# EAGLE design Flyback Develop (EAGLE 9.6.2)
AUTH_NAME: MNa; REV_NO: A
Assembly variants: Assembly_1

## Sheet 1 of 2: Concept
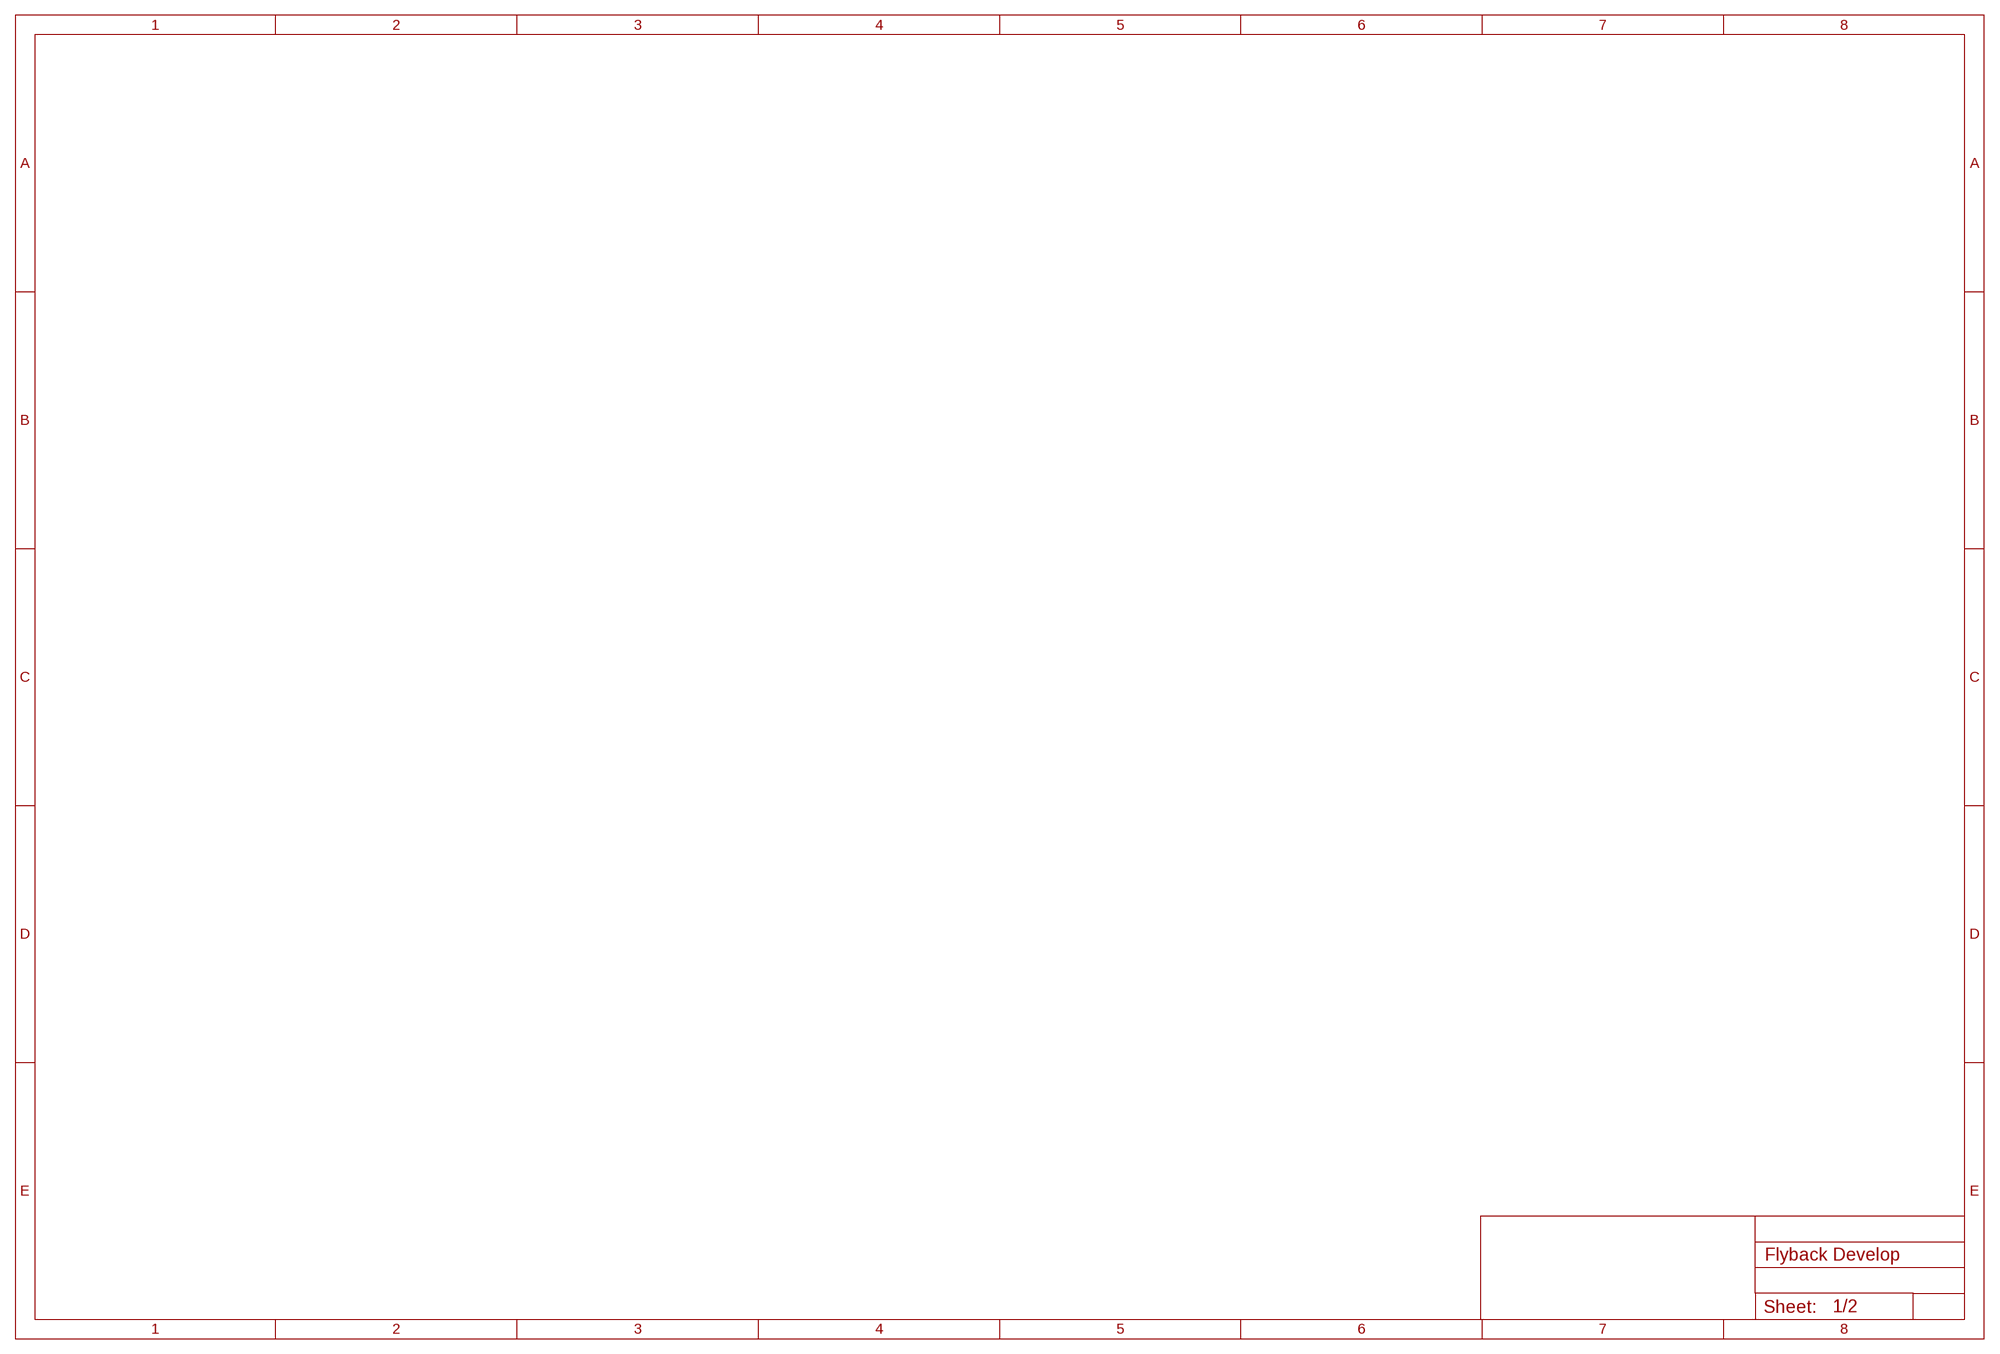
[diagram p0: schematic, sheet 1]

## Sheet 2 of 2: Inputs
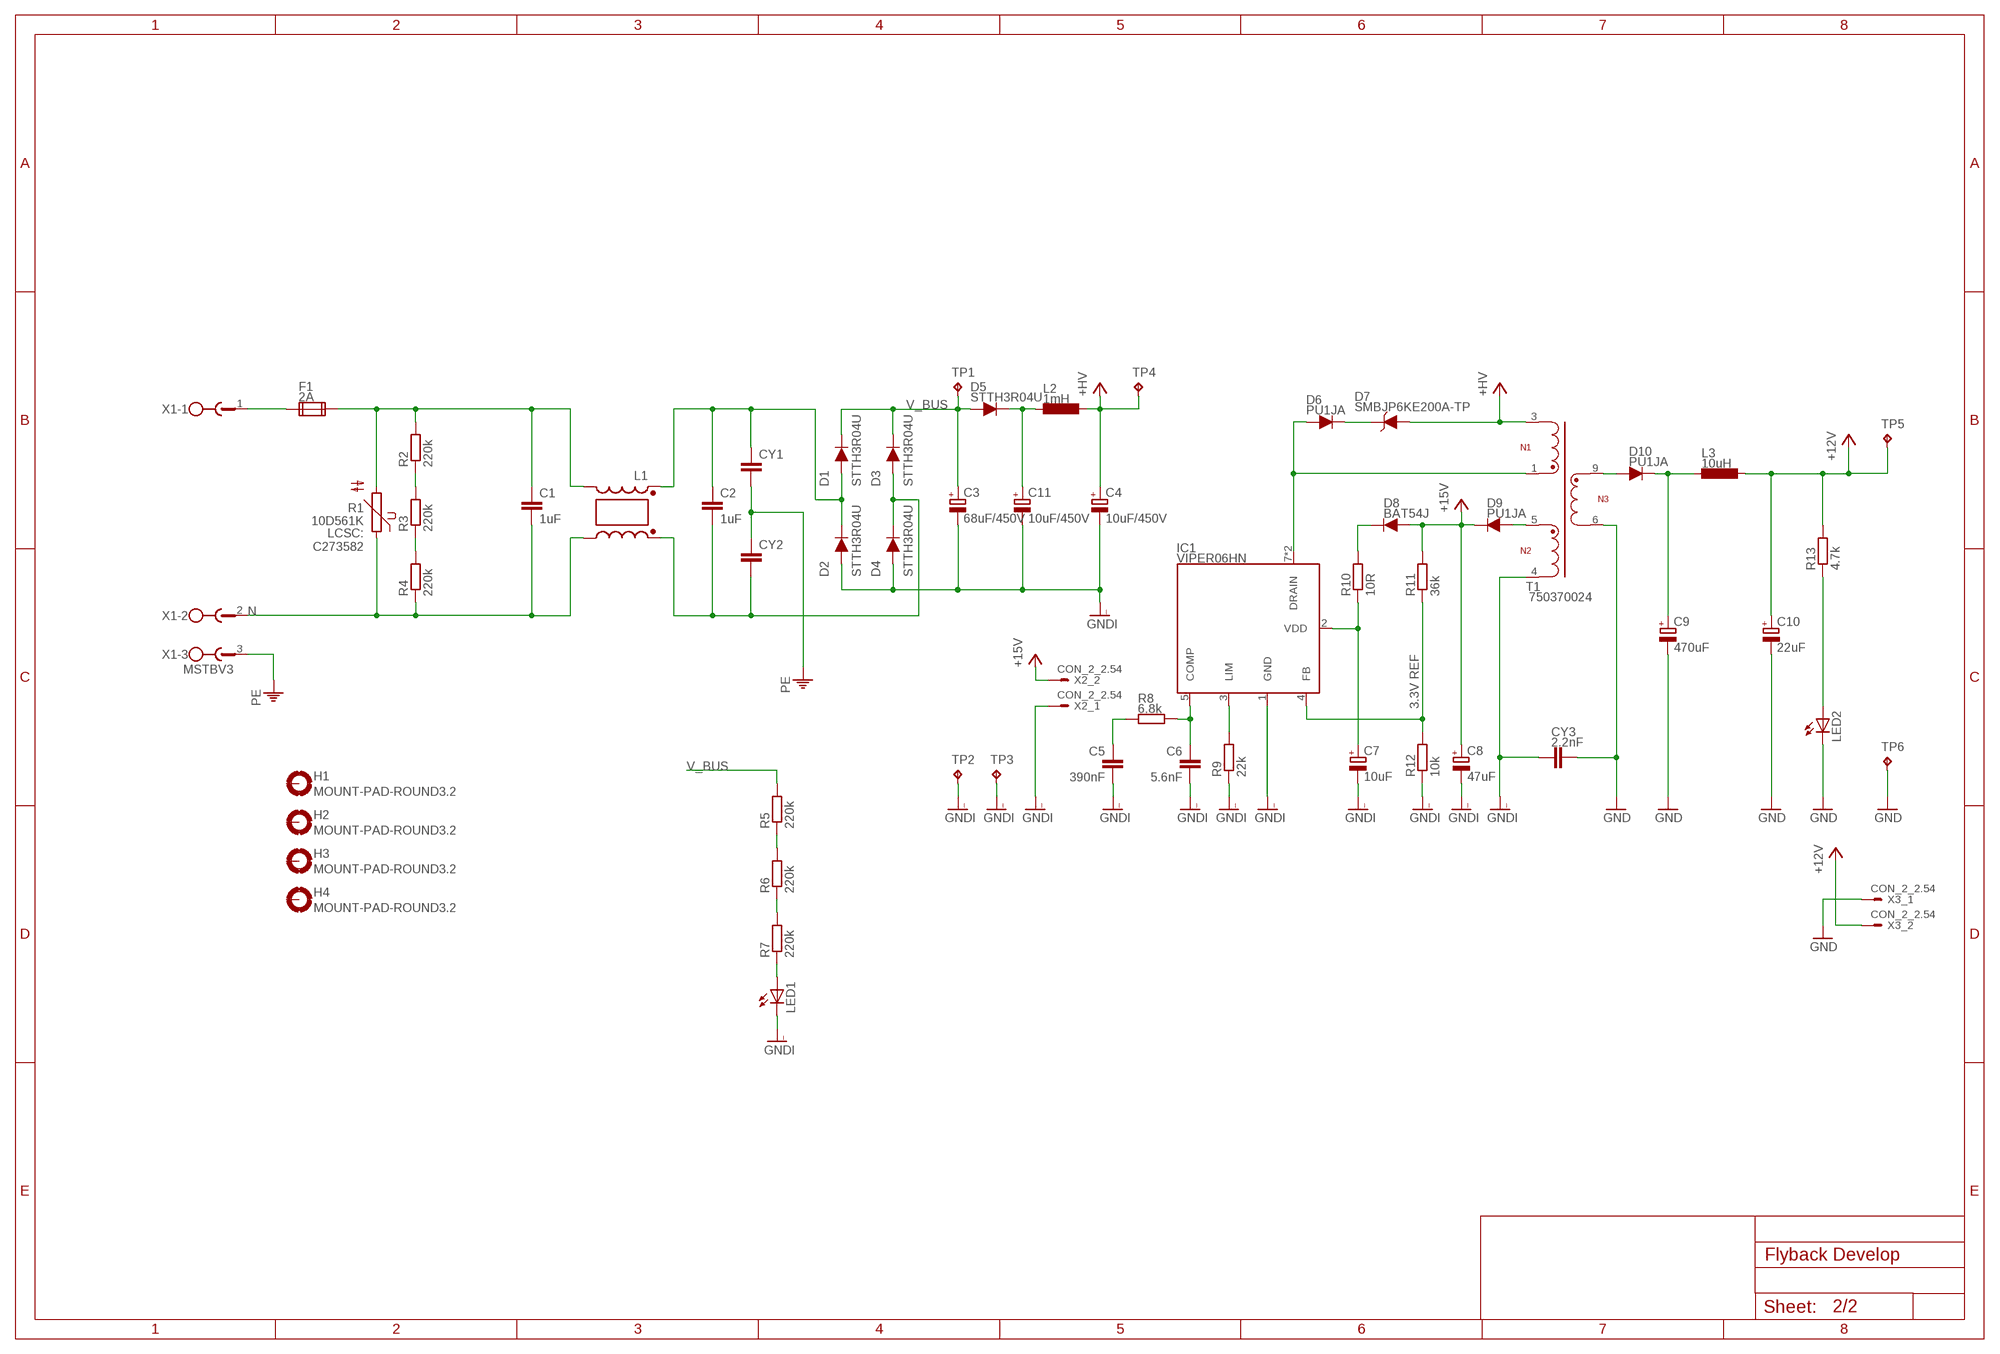
[diagram p1: schematic, sheet 2]

### Parts
C1  1uF  C-EU102-082X133  [C102-082X133]
C2  1uF  C-EU102-082X133  [C102-082X133]
C3  68uF/450V  CPOL-EUE7.5-18  [E7,5-18]
C4  10uF/450V  CPOL-EUE3.5-10  [E3,5-10]
C5  390nF  C-EUC0603  [C0603]
C6  5.6nF  C-EUC0603  [C0603]
C7  10uF  CPOL-EUE2.5-5  [E2,5-5]
C8  47uF  CPOL-EUE2.5-7  [E2,5-7]
C9  470uF  CPOL-EUE3.5-8  [E3,5-8]
C10  22uF  CPOL-EUE2-5  [E2-5]
C11  10uF/450V  CPOL-EUE3.5-10  [E3,5-10]
CY1  CYYC7B5  [YC7B5]
CY2  CYYC7B5  [YC7B5]
CY3  2.2nF  CYYC7B5  [YC7B5]
D1  STTH3R04U  DIODESMB  [SMB]
D2  STTH3R04U  DIODESMB  [SMB]
D3  STTH3R04U  DIODESMB  [SMB]
D4  STTH3R04U  DIODESMB  [SMB]
D5  STTH3R04U  DIODESMB  [SMB]
D6  PU1JA  DIODEDO214AC  [DO214AC]
D7  SMBJP6KE200A-TP  TVS_DIODE_UNISMA  [DO214AC]
D8  BAT54J  DIODE  [SOD123]
D9  PU1JA  DIODEDO214AC  [DO214AC]
D10  PU1JA  DIODEDO214AC  [DO214AC]
F1  2A  FUSE2010  [2010-FUSE]
H1  MOUNT-PAD-ROUND3.2  [3,2-PAD]
H2  MOUNT-PAD-ROUND3.2  [3,2-PAD]
H3  MOUNT-PAD-ROUND3.2  [3,2-PAD]
H4  MOUNT-PAD-ROUND3.2  [3,2-PAD]
IC1  VIPER06HN  [DIL07]
L1  20mH  COMMON_MODE_CHOKE_SLT  [CMC_SLT]
L2  1mH  COIL_1MH  [SLH0704]
L3  10uH  10UH_4X4  [COIL_4X4]
LED1  LED_0805  [LED_0805]
LED2  LED_0805  [LED_0805]
R1  10D561K  S10K175  [S10K175]
R2  220k  R-EU_R1210  [R1210]
R3  220k  R-EU_R1210  [R1210]
R4  220k  R-EU_R1210  [R1210]
R5  220k  R-EU_R1210  [R1210]
R6  220k  R-EU_R1210  [R1210]
R7  220k  R-EU_R1210  [R1210]
R8  6.8k  R-EU_R0603  [R0603]
R9  22k  R-EU_R0603  [R0603]
R10  10R  R-EU_R0805  [R0805]
R11  36k  R-EU_R0603  [R0603]
R12  10k  R-EU_R0603  [R0603]
R13  4.7k  R-EU_R0603  [R0603]
T1  750370024  750370024  [WE-OLSTM_EE13_L13.72W20.45H10.8]
TP1  TP_SOLDREYE  [SOLDER_EYE]
TP2  TP_SOLDREYE  [SOLDER_EYE]
TP3  TP_SOLDREYE  [SOLDER_EYE]
TP4  TP_SOLDREYE  [SOLDER_EYE]
TP5  TP_SOLDREYE  [SOLDER_EYE]
TP6  TP_SOLDREYE  [SOLDER_EYE]
X1  MSTBV3  [MSTBV3]
X2  CON_2_2.54  [1X02]
X3  CON_2_2.54  [1X02]

### Nets
+12V: C10.+ L3.1 R13.2 TP5.1(TP) X3.2
+15V: C8.+ D8.2(A) D9.C R11.2 X2.2
+HV [High_Voltage]: C4.+ D7.A L2.1 T1.3 TP4.1(TP)
GND: C9.- C10.- CY3.2 LED2.C T1.6 TP6.1(TP) X3.1
GNDI: C3.- C4.- C5.2 C6.2 C7.- C8.- C11.- CY3.1 D2.A D4.A IC1.1(GND) LED1.C R9.1 R12.1 T1.4 TP2.1(TP) TP3.1(TP) X2.1
L': C1.1 F1.P$2 L1.OUT1 R1.2 R2.2
N: C1.2 L1.OUT2 R1.1 R4.1 X1.2
N$1: D6.C D7.C
N$2: R5.1 R6.2
N$3: R6.1 R7.2
N$4: LED1.A R7.1
N$5: C9.+ D10.C L3.2
N$6: LED2.A R13.1
N$7 [High_Voltage]: C11.+ D5.C L2.2
N$10 [High_Voltage]: C2.2 CY2.2 D3.A D4.C L1.IN2
N$11: F1.P$1 X1.1
N$15: R2.1 R3.2
N$16: R3.1 R4.2
N$17: D10.A T1.9
N$20 [High_Voltage]: D6.A IC1.7(DRAIN) IC1.8(DRAIN) T1.1
N$21: C5.1 R8.1
N$22: D8.1(C) R10.2
N$23: C7.+ IC1.2(VDD) R10.1
N$24: IC1.3(LIM) R9.2
N$25: D9.A T1.5
N$26: IC1.4(FB) R11.1 R12.2
N$27: C6.1 IC1.5(COMP) R8.2
N$61 [High_Voltage]: C2.1 CY1.1 D1.A D2.C L1.IN1
PE: CY1.2 CY2.1 X1.3
V_BUS [High_Voltage]: C3.+ D1.C D3.C D5.A R5.2 TP1.1(TP)
Unconnected: H1.B3,2(MOUNT) H2.B3,2(MOUNT) H3.B3,2(MOUNT) H4.B3,2(MOUNT)

### Notes on the sheet
- LCSC:
  C273582
- 3.3V REF

## Library data of the parts
C1 C2 C5 C6 = rcl_MICHAEL:C-EU: CAPACITOR, European symbol; SPICEPREFIX: C
C3 C4 C7-C11 = rcl_MICHAEL:CPOL-EU: POLARIZED CAPACITOR, European symbol; SPICEPREFIX: C
CY1-CY3 = rcl_MICHAEL:CY: Y CAPACITOR for power line; SPICEPREFIX: C
D1-D6 D8-D10 = lib_CASE_STUDY19:DIODE: Diodes
D7 = lib_CASE_STUDY19:TVS_DIODE_UNI: Unipolar TVS Diode
F1 = lib_CASE_STUDY19:FUSE: Fuse Holders
H1-H4 = holes:MOUNT-PAD-ROUND: MOUNTING PAD, round
IC1 = lib_CASE_STUDY19:VIPER: IC OFFLINE SWITCH MULT TOP 7DIP; OC: 497-12990-5-ND; SUPPLIER: Digikey
L1 = lib_CASE_STUDY19:COMMON_MODE_CHOKE: Common mode chokes; OC: C5149051; SUPPLIER: LCSC
L2 = lib_CASE_STUDY19:COIL: Coil; OC: C364094; SUPPLIER: LCSC
L3 = lib_CASE_STUDY19:10UH: 10uH Coils; OC: C5363823; SUPPLIER: LCSC
LED1 LED2 = lib_CASE_STUDY19:LED: LED
R1 = varistor:S10K175: VARISTOR
R2-R13 = rcl_MICHAEL:R-EU_: RESISTOR, European symbol; SPICEPREFIX: R
T1 = WE-OLSTM:750370024: WE-OLSTM Offline Flyback Transformers Characteristics Nominal input voltage: 85–265 VAC (120–375 VDC) Operating temperature: –40 °C to +125 °C Isolation voltage: 2 kVAC up to 5 kVAC Multiple output options Options for fixed frequency or quasi-resonant mode operation Most products meet reinforced insulation Applications Offline-switch mode power supplies Especially designed for several ICs from STMicroelectronics Auxiliary power supply Home appliances Consumer electronics <https://www.we-online.com/components/media/o781306v209%20FAMILY-MID-OLSTM.jpg> Details see: www.we-online.com/en/components/products/WE-OLSTM <www.we-online.com/en/components/products/WE-OLSTM/?utm_source=eagle_model&utm_medium=description_link&utm_campaign=eisos_eagle> Created by Leviosa 2024-04-15 2024(C) Wurth Elektronik; DATASHEET-URL: https://www.we-online.com/redexpert/spec/750370024?ae; FSWITCH: 115kHz; IOUT1: 500mA; ISAT: 340mA; L: 1.6mH; MOUNT: THT; N: 8:1:1.33; PART-NUMBER: 750370024; SIZE: EE13/7/4; VAUX: 16V; VIN: 85 - 424 V (AC); VOUT1: 12V; VT: 4000V(AC)
TP1-TP6 = lib_CASE_STUDY19:TP: Test pad
X1 = con-phoenix-508:MSTBV3: PHOENIX; MPN: MSTBV 2,5/3-GF-5.08; OC_FARNELL: 1792793; OC_NEWARK: 69R9846
X2 X3 = lib_CASE_STUDY19:CON_2: 2 Pin connector General purpose

## Net classes
0 default: width 0.15 mm, drill 0.2 mm, clearance 0.2 mm
1 High_Voltage: width 0.2 mm, drill 0.2 mm, clearance 2 mm to class 0, clearance 2 mm

## Board
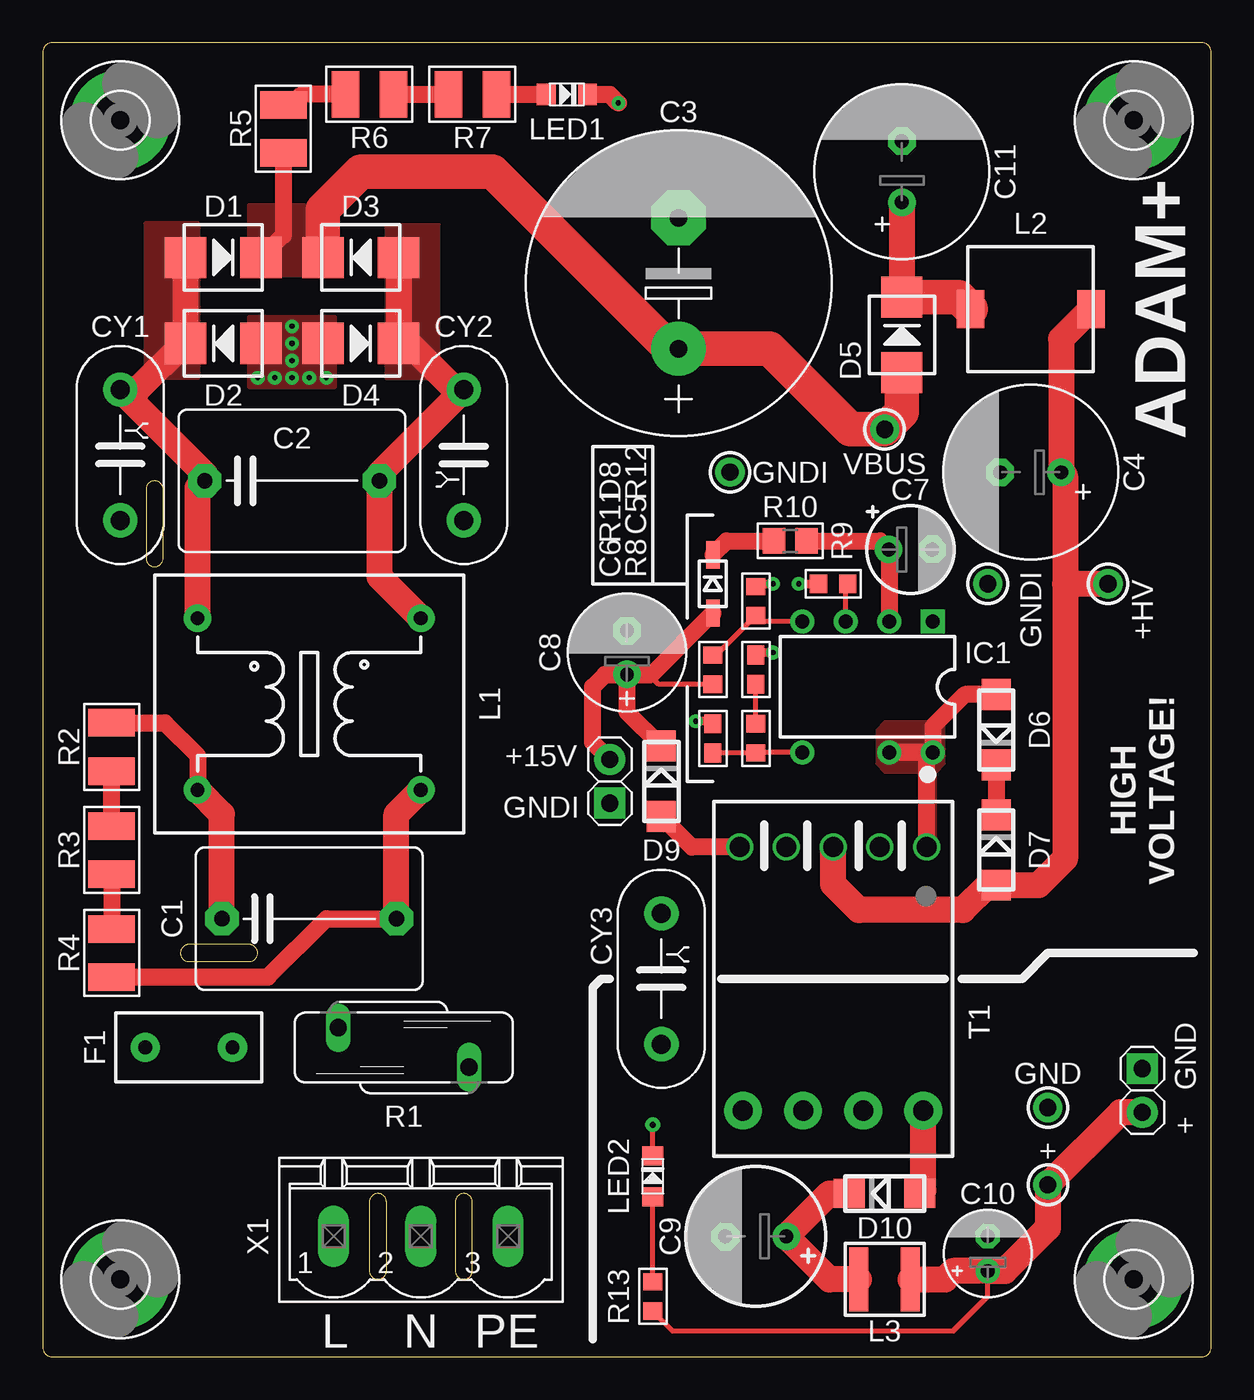
[diagram p2: board, top side]
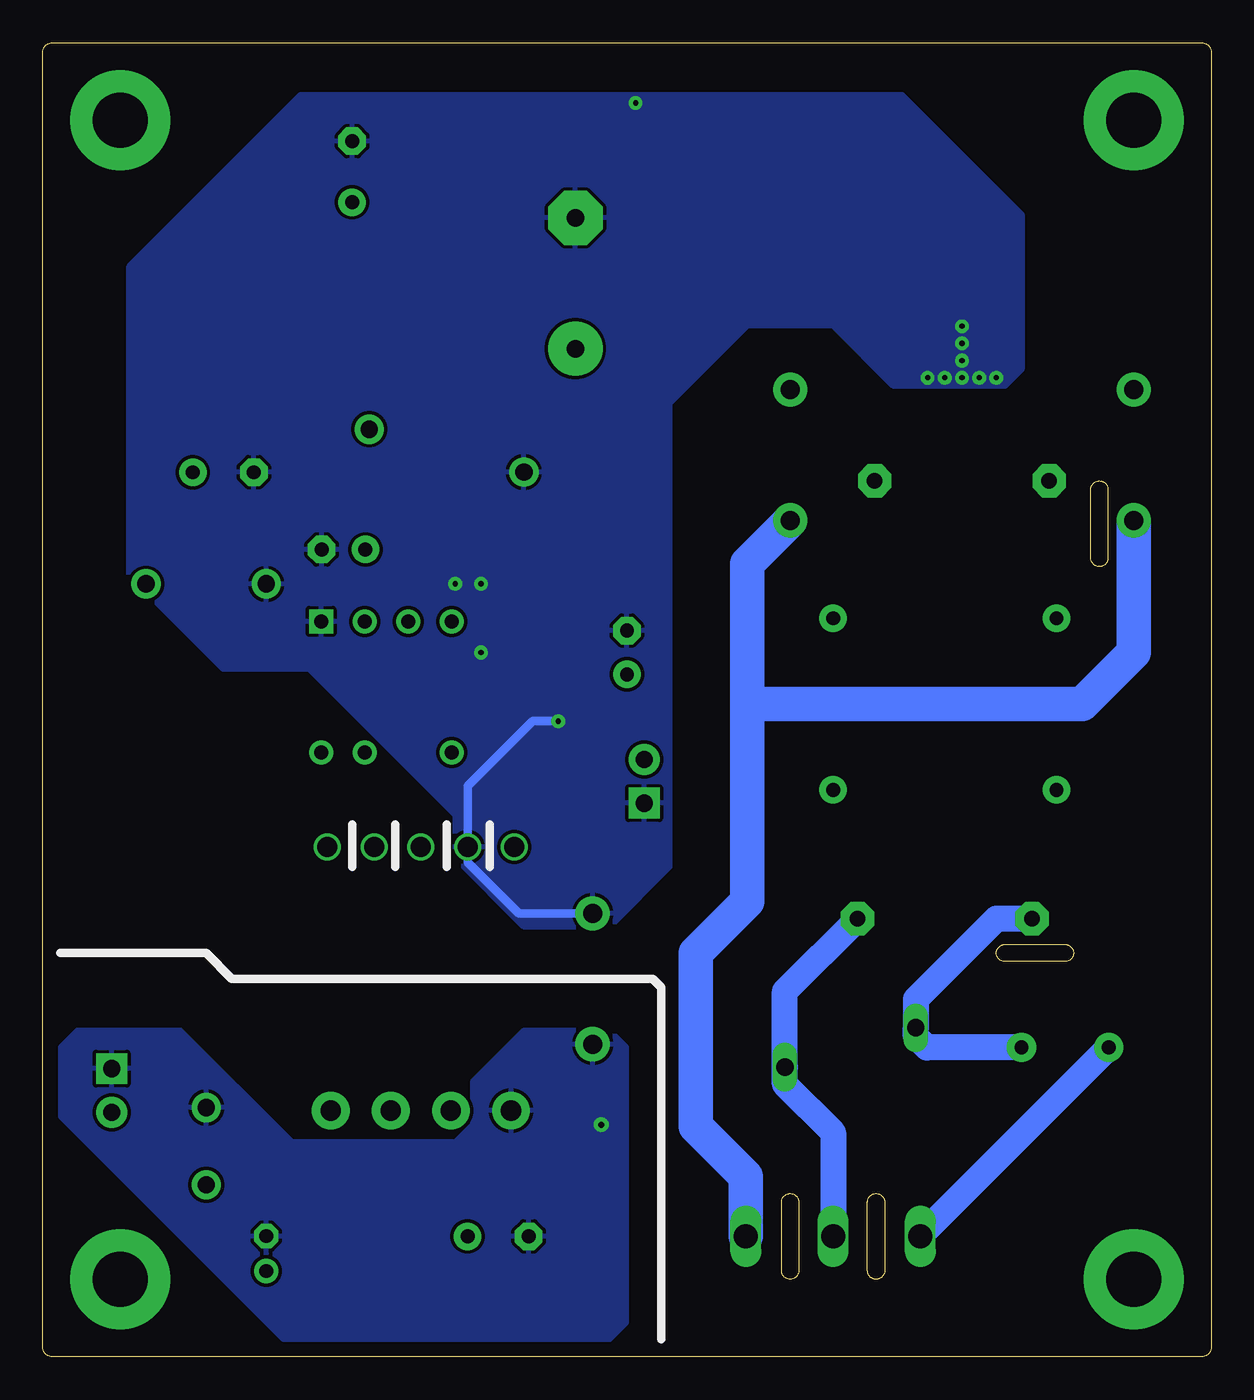
[diagram p3: board, bottom side, seen from below]

Size 68 x 76.5 mm. Coordinates in mm from the lower left corner, seen from the top.
Outline: 0,0.5 arc90 0.5,0 67.5,0 arc90 68,0.5 68,76 arc90 67.5,76.5 0.5,76.5 arc90 0,76 0,0.5
Outline: 19,9 19,5 arc90 19.5,4.5 arc90 20,5 20,9 arc90 19.5,9.5 arc90 19,9
Outline: 24,9 24,5 arc90 24.5,4.5 arc90 25,5 25,9 arc90 24.5,9.5 arc90 24,9
Outline: 8.5,23 12,23 arc90 12.5,23.5 arc90 12,24 8.5,24 arc90 8,23.5 arc90 8.5,23
Outline: 7,46.5 7,50.5 arc90 6.5,51 arc90 6,50.5 6,46.5 arc90 6.5,46 arc90 7,46.5
Copper layers (1*16): Top 0.035mm / dielectric 1.5mm / Bottom 0.035mm
Design rules "PCB-POOL Standard *": minimum track width 0.2mm, minimum drill 0.3mm, track to track 0.2mm, track to pad 0.2mm, pad to pad 0.2mm, via to via 0.2mm, smd to smd 0.2mm, copper to edge 0.25mm, drill to drill 0.2mm, minimum pad ring 0.2mm, minimum via ring 0.25mm, stop-mask expansion 0.03mm, vias tented up to drill 13mm, thermal gap 0.2mm

### Footprints (pad centres in the part's own frame; a part is rotated, then mirrored left to right if it is on the bottom)
C102-082X133 = drill 0.9 pad 1.93 octagon: 1 -5.08,0; 2 5.08,0
E7,5-18 = drill 1.016 pad 3.15: + -3.81,0 | drill 1.016 pad 3.15 octagon: - 3.81,0
E3,5-10 = drill 0.8 pad 1.6: + -1.778,0 | drill 0.8 pad 1.6 octagon: - 1.778,0
C0603 = smd 1.1 x 1: 1 -0.85,0; 2 0.85,0
E2,5-5 = drill 0.813 pad 1.6: + -1.27,0 | drill 0.813 pad 1.6 octagon: - 1.27,0
E2,5-7 = drill 0.813 pad 1.6: + -1.27,0 | drill 0.813 pad 1.6 octagon: - 1.27,0
E3,5-8 = drill 0.813 pad 1.6: + -1.778,0 | drill 0.813 pad 1.6 octagon: - 1.778,0
E2-5 = drill 0.8 pad 1.422: + -1.016,0 | drill 0.8 pad 1.422 octagon: - 1.016,0
YC7B5 = drill 1.1 pad 2: 1 -3.81,0; 2 3.81,0
SMB = smd 2.4 x 2.4: A 2.2,0; C -2.2,0
DO214AC = smd 1.8 x 1.7: A 2.05,0; C -2.05,0
SOD123 = smd 1.6 x 0.8: 1 -1.7,0; 2 1.7,0
2010-FUSE = drill 0.8 pad 1.7: P$1 -2.54,0; P$2 2.54,0
3,2-PAD = drill 3.2 pad 5.842: B3,2 0,0
DIL07 = drill 0.813 pad 1.4 square: 1 -3.81,-3.81 | drill 0.813 pad 1.4: 2 -1.27,-3.81; 3 1.27,-3.81; 4 3.81,-3.81; 5 3.81,3.81; 7 -1.27,3.81; 8 -3.81,3.81
CMC_SLT = drill 0.8 pad 1.6: IN1 -5,-6.5; IN2 -5,6.5; OUT1 5,-6.5; OUT2 5,6.5
SLH0704 = smd 1.6 x 2.2: 1 -3.5,0; 2 3.5,0
COIL_4X4 = smd 1.1 x 3.7: 1 -1.5,0; 2 1.5,0
LED_0805 = smd 1.1 x 1.25: A 1.2,0; C -1.2,0
S10K175 = drill 1.016 long: 1 -1.143,-3.81; 2 1.143,3.81
R1210 = smd 1.6 x 2.7: 1 -1.4,0; 2 1.4,0
R0603 = smd 1 x 1.1: 1 -0.85,0; 2 0.85,0
R0805 = smd 1.3 x 1.5: 1 -0.95,0; 2 0.95,0
WE-OLSTM_EE13_L13.72W20.45H10.8 = drill 1.17: 1 -7.675,5.44; 2 -7.675,2.72; 3 -7.675,0; 4 -7.675,-2.72; 5 -7.675,-5.44 | drill 1.17 pad 2.2: 6 7.675,-5.25; 7 7.675,-1.75; 8 7.675,1.75; 9 7.675,5.25
SOLDER_EYE = drill 1 pad 1.7: 1 0,0
MSTBV3 = drill 1.397 long: 1 -5.08,0; 2 0,0; 3 5.08,0
1X02 = drill 1 pad 1.8 square: 1 -1.27,0 | drill 1 pad 1.8: 2 1.27,0

### Placement (x,y rotation side)
C1  15.5,25.5 0 top
C2  14.5,51 0 top
C3  37,62.5 90 top
C4  57.5,51.5 180 top
C5  41.5,40 90 top
C6  39,36 90 top
C7  50.5,47 0 top
C8  34,41 90 top
C9  41.5,7 180 top
C10  55,6 90 top
C11  50,69 90 top
CY1  4.5,52.5 270 top
CY2  24.5,52.5 90 top
CY3  36,22 270 top
D1  10.5,64 180 top
D2  10.5,59 0 top
D3  18.5,64 0 top
D4  18.5,59 180 top
D5  50,59.5 270 top
D6  55.5,36.5 90 top
D7  55.5,29.5 270 top
D8  39,45 270 top
D9  36,33.5 270 top
D10  49,9.5 0 top
F1  8.5,18 0 top
H1  4.5,4.5 0 top
H2  4.5,72 0 top
H3  63.5,4.5 0 top
H4  63.5,72 0 top
IC1  48,39 180 top
L1  15.5,38 270 top
L2  57.5,61 180 top
L3  49,4.5 180 top
LED1  30.5,73.5 180 top
LED2  35.5,10.5 270 top
R1  21,18 90 top
R2  4,35.5 90 top
R3  4,29.5 90 top
R4  4,23.5 90 top
R5  14,71.5 270 top
R6  19,73.5 180 top
R7  25,73.5 180 top
R8  41.5,36 270 top
R9  46,45 0 top
R10  43.5,47.5 180 top
R11  39,40 270 top
R12  41.5,44 270 top
R13  35.5,3.5 270 top
T1  46,22 270 top
TP1  49,54 0 top
TP2  40,51.5 0 top
TP3  55,45 0 top
TP4  62,45 0 top
TP5  58.5,10 0 top
TP6  58.5,14.5 0 top
X1  22,7 0 top
X2  33,33.5 90 top
X3  64,15.5 270 top

### Tracks (layer width: path | path; a pad name or v marks a point on that pad's centre or on a via)
+12V
  Top 0.3: R13.2 36.65,1.5 53,1.5 55,3.5 C10.+
  Top 1.5: L3.1 52.5,4.5 52.98,4.98 C10.+ 56,4.98 58.5,7.48 TP5.1 62.73,14.23 X3.2
+15V
  Top 0.3: R11.2 35.85,39.15 35.27,39.73 C8.+
  Top 1: C8.+ 34,37.55 D9.C | C8.+ 35.43,39.73 D8.2 | X2.2 32,35.77 32,39 32.73,39.73 C8.+
+HV
  Top 1.5: 59.5,45 59.5,51.28 C4.+ 59.28,59.28 L2.1 | 59.5,45 59.5,29 57.95,27.45 D7.A 55,27.45 53.55,26 47.5,26 46,27.5 T1.3 | TP4.1 59.5,45
GND  (via drill 0.35)
  Top 0.3: LED2.C v35.5,13.5
  pour Bottom: 34,18 35,19 40,19 43,16 43,13.5 44,12.5 53.5,12.5 60,19 66,19 67,18 67,14 54,1 35,1 34,2
GNDI  (via drill 0.3)
  Top 0.5: C6.2 38.85,37 v38,37 | C5.2 41.65,41 v42.5,41 | R12.1 41.65,45 v42.5,45 | R9.1 v44,45
  Top 1: LED1.C 33,73.5 v33.5,73
  Bottom 0.5: v38,37 39.5,37 43.28,33.22 T1.4 43.28,28.78 40.31,25.81 CY3.1
  other vias: 12.5,57 13.5,57 14.5,57 16.5,57 15.5,57 14.5,58 14.5,59 14.5,60
  pour Bottom: 11,66.5 11,57.5 12,56.5 18.5,56.5 22,60 27,60 31.5,55.5 31.5,28.5 35,25 40,25 44,29 44,31.5 52.5,40 57.5,40 63,45.5 63,63.5 53,73.5 18,73.5
  pour Top (no thermals): 17,56.5 17,60.5 12,60.5 12,56.5
L'
  Top 1: R2.2 7.1,36.9 9,35 L1.OUT1
  Top 1.5: C1.1 10.42,31.58 L1.OUT1
  Bottom 1.5: F1.P$2 16.55,18 17.19,18.64 R1.2 17.19,20.81 12.5,25.5 C1.1
N
  Top 1: R4.1 13.1,22.1 16.5,25.5 C1.2
  Top 1.5: C1.2 20.58,31.58 L1.OUT2
  Bottom 1.5: X1.2 22,13.05 24.81,15.86 R1.1 24.81,21.27 C1.2
N$1
  Top 1: D6.C D7.C
N$2
  Top 1: R6.2 15.1,73.5 14.5,72.9 R5.1
N$3
  Top 1: R6.1 R7.2
N$4
  Top 1: R7.1 LED1.A
N$5
  Top 1.5: L3.2 45.78,4.5 C9.+ 45.78,9.5 D10.C
N$6
  Top 0.3: R13.1 LED2.A
N$7
  Top 1.5: C11.+ D5.C
  Top 2: L2.2 53.3,61.7 D5.C
N$10
  Top 1.5: D3.A D4.C 21.31,59 24,56.31 CY2.2 19.58,51.39 C2.2 19.58,45.42 L1.IN2
  pour Top (no thermals): 20,66 20,57 23,57 23,66
N$11
  Bottom 1.5: F1.P$1 16.92,7.04 X1.1
N$15
  Top 1: R3.2 R2.1
N$16
  Top 1: R3.1 R4.2
N$17
  Top 1.5: D10.A 51.25,9.7 T1.9
N$20
  Top 1: D6.A 53.67,38.55 51.81,36.69 IC1.8 | IC1.8 IC1.7 | T1.1 51.44,34.82 IC1.8
  pour Top (no thermals): 48.5,36.5 48.5,34.5 49,34 51,34 51,29.5 52,29.5 52,34 52.5,34.5 52.5,37 49,37
N$21
  Top 0.3: R8.1 C5.1
N$22
  Top 1: D8.1 39.8,47.5 R10.2
N$23
  Top 1: R10.1 48.73,47.5 C7.+ 49.27,46.96 IC1.2
N$24
  Top 0.3: IC1.3 46.73,44.88 R9.2
N$25
  Top 1: T1.5 37.77,29.68 D9.A
N$26
  Top 0.3: IC1.4 41.84,42.81 R12.2 39.2,40.85 R11.1
N$27
  Top 0.3: IC1.5 41.54,35.19 R8.2 C6.1
N$61
  Top 1: D2.C 8.19,59
  Top 1.5: L1.IN1 9,50.58 C2.1 9.42,51.39 CY1.1 5.5,56.31 8.19,59 | D2.C D1.A
  pour Top (no thermals): 6,66 9,66 9,57 6,57
PE
  Bottom 2: CY1.2 4.5,41 7.5,38 27,38 | 27,38 27,46.19 CY2.1 | 27,38 27,26.5 30,23.5 30,13.42 27.08,10.5 X1.3
V_BUS
  Top 1: R5.2 14,65.3 D1.C
  Top 2: D5.A 50,55 TP1.1 47,54 42.31,58.69 C3.+ 36.5,58.69 26.19,69 18.5,69 16.3,66.8 D3.C
  pour Top (no thermals): 12,67 12,63 17,63 17,67

### Text on the board
tPlace: ADAM+ | GNDI | VBUS | GNDI | +HV | +15V | HIGH / VOLTAGE! | GNDI | GND | GND | + | + | L | N | PE